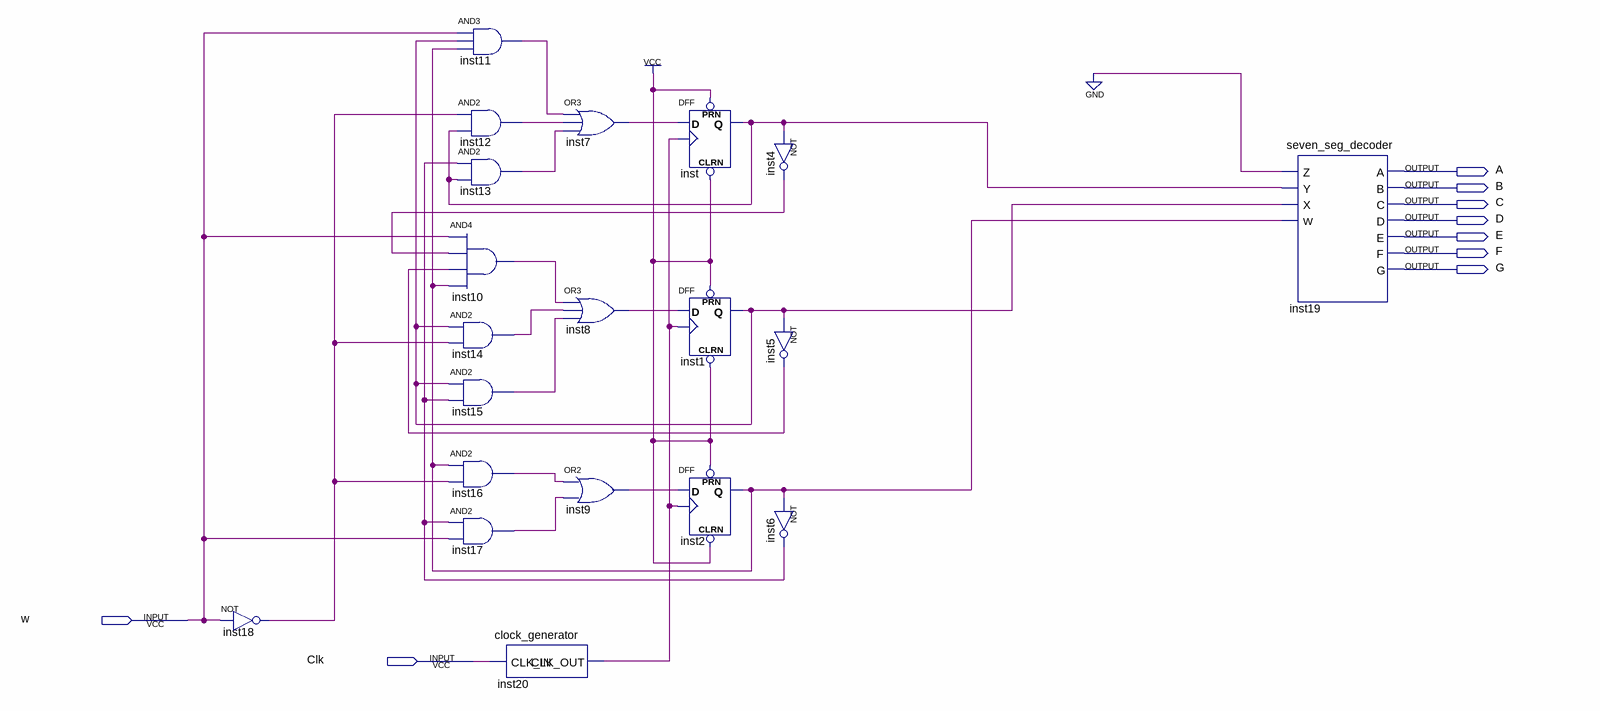
[diagram p0: schematic sheet]
// Quartus schematic lab11step1.bdf as structural Verilog: 20 symbols, 9 pins
module lab11step1 (
  input  w,
  input  Clk,
  output A,
  output B,
  output C,
  output D,
  output E,
  output F,
  output G
);

  wire inst1_q, inst2_q, inst4_out, inst5_out, inst6_out, inst7_out, inst8_out, inst9_out, inst10_out,
       inst11_out, inst12_out, inst13_out, inst14_out, inst15_out, inst16_out, inst17_out, inst18_out,
       inst20_clk_out, inst_q;

  not inst18 (inst18_out, w);
  and inst11 (inst11_out, w, inst1_q, inst2_q);
  and inst12 (inst12_out, inst18_out, inst_q);
  and inst13 (inst13_out, inst6_out, inst_q);
  and inst10 (inst10_out, w, inst4_out, inst5_out, inst2_q);
  and inst14 (inst14_out, inst1_q, inst18_out);
  and inst15 (inst15_out, inst1_q, inst6_out);
  and inst16 (inst16_out, inst2_q, inst18_out);
  and inst17 (inst17_out, inst6_out, w);
  clock_generator inst20 (.CLK_IN(Clk), .CLK_OUT(inst20_clk_out));
  or inst7 (inst7_out, inst11_out, inst12_out, inst13_out);
  or inst8 (inst8_out, inst10_out, inst14_out, inst15_out);
  or inst9 (inst9_out, inst16_out, inst17_out);
  DFF inst (.CLRN(1'b1), .CLK(inst20_clk_out), .D(inst7_out), .PRN(1'b1), .Q(inst_q));
  DFF inst1 (.CLRN(1'b1), .CLK(inst20_clk_out), .D(inst8_out), .PRN(1'b1), .Q(inst1_q));
  DFF inst2 (.CLRN(1'b1), .CLK(inst20_clk_out), .D(inst9_out), .PRN(1'b1), .Q(inst2_q));
  not inst4 (inst4_out, inst_q);
  not inst5 (inst5_out, inst1_q);
  not inst6 (inst6_out, inst2_q);
  seven_seg_decoder inst19 (
    .Z(1'b0), .Y(inst_q), .X(inst1_q), .W(inst2_q), .A(A), .B(B), .C(C), .D(D), .E(E), .F(F), .G(G));
endmodule
